# Altium schematic sheet Sheet3.SchDoc
size A; SheetNumber: 3; SheetTotal: 3
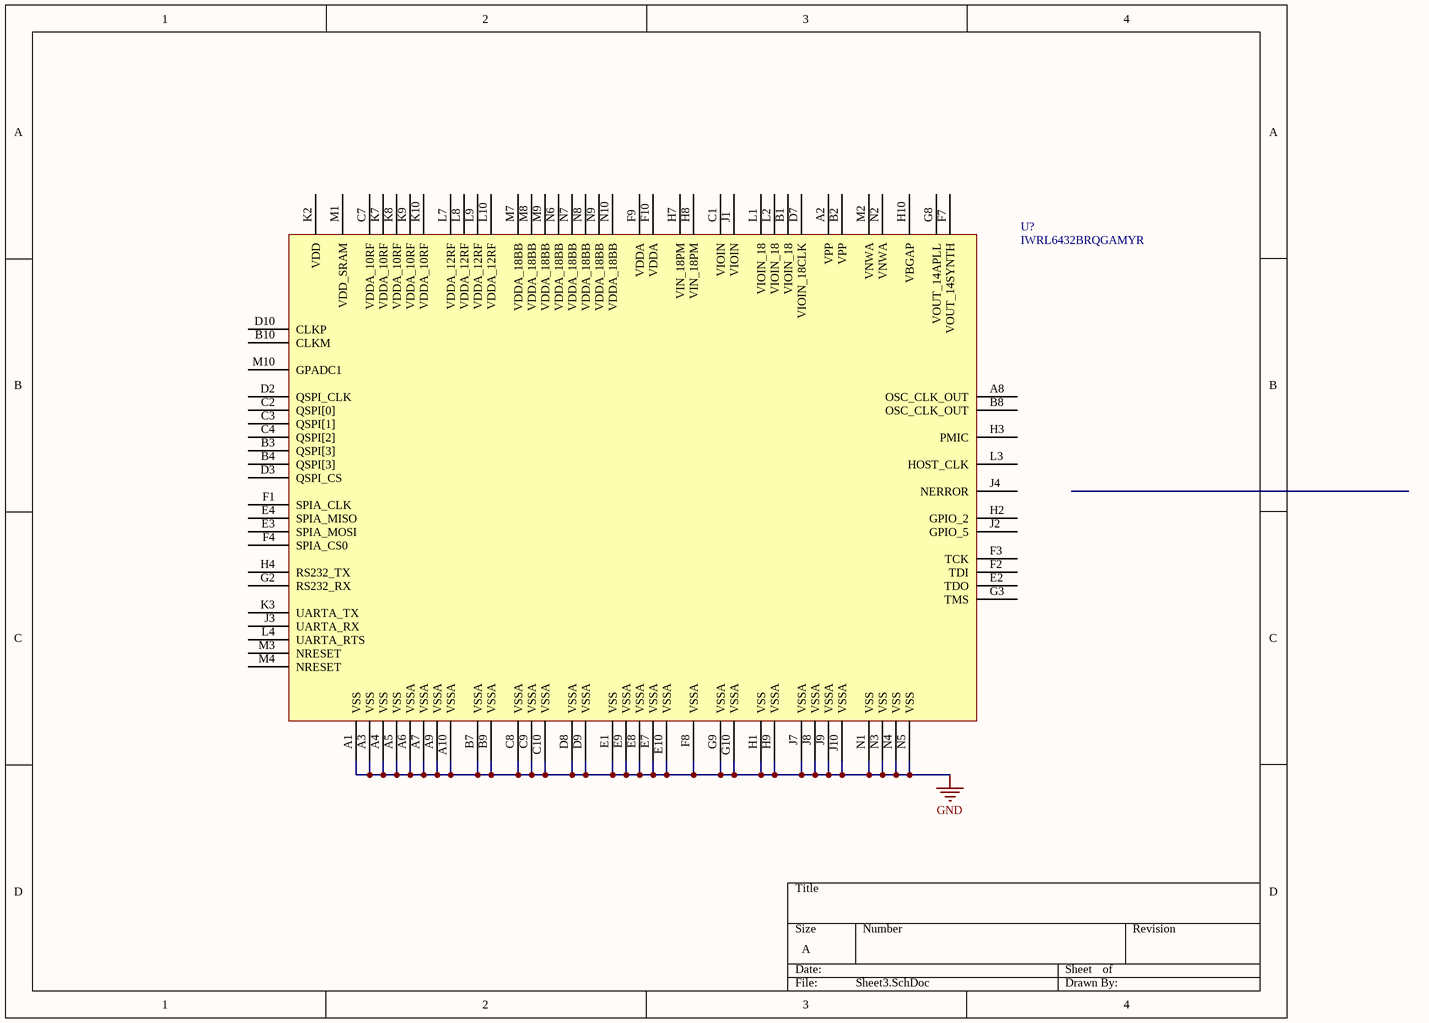
[diagram p0: Sheet3.SchDoc]

## Parts
U?  IWRL6432BRQGAMYR

## Nets
GND: U?.A1(VSS) U?.A3(VSS) U?.A4(VSS) U?.A5(VSS) U?.A6(VSSA) U?.A7(VSSA) U?.A9(VSSA) U?.A10(VSSA) U?.B7(VSSA) U?.B9(VSSA) U?.C8(VSSA) U?.C9(VSSA) U?.C10(VSSA) U?.D8(VSSA) U?.D9(VSSA) U?.E1(VSS) U?.E7(VSSA) U?.E8(VSSA) U?.E9(VSSA) U?.E10(VSSA) U?.F8(VSSA) U?.G9(VSSA) U?.G10(VSSA) U?.H1(VSS) U?.H9(VSSA) U?.J7(VSSA) U?.J8(VSSA) U?.J9(VSSA) U?.J10(VSSA) U?.N1(VSS) U?.N3(VSS) U?.N4(VSS) U?.N5(VSS)

Not connected (* = marked no-connect by the designer): U? A2(VPP) A8(OSC_CLK_OUT) B1(VIOIN_18) B2(VPP) B3(QSPI[3]) B4(QSPI[3]) B8(OSC_CLK_OUT) B10(CLKM) C1(VIOIN) C2(QSPI[0]) C3(QSPI[1]) C4(QSPI[2]) C7(VDDA_10RF) D2(QSPI_CLK) D3(QSPI_CS) D7(VIOIN_18CLK) D10(CLKP) E2(TDO) E3(SPIA_MOSI) E4(SPIA_MISO) F1(SPIA_CLK) F2(TDI) F3(TCK) F4(SPIA_CS0) F7(VOUT_14SYNTH) F9(VDDA) F10(VDDA) G2(RS232_RX) G3(TMS) G8(VOUT_14APLL) H2(GPIO_2) H3(PMIC) H4(RS232_TX) H7(VIN_18PM) H8(VIN_18PM) H10(VBGAP) J1(VIOIN) J2(GPIO_5) J3(UARTA_RX) J4(NERROR) K2(VDD) K3(UARTA_TX) K7(VDDA_10RF) K8(VDDA_10RF) K9(VDDA_10RF) K10(VDDA_10RF) L1(VIOIN_18) L2(VIOIN_18) L3(HOST_CLK) L4(UARTA_RTS) L7(VDDA_12RF) L8(VDDA_12RF) L9(VDDA_12RF) L10(VDDA_12RF) M1(VDD_SRAM) M2(VNWA) M3(NRESET) M4(NRESET) M7(VDDA_18BB) M8(VDDA_18BB) M9(VDDA_18BB) M10(GPADC1) N2(VNWA) N6(VDDA_18BB) N7(VDDA_18BB) N8(VDDA_18BB) N9(VDDA_18BB) N10(VDDA_18BB)

## Library data of the parts
U? = IWRL6432BRQGAMYR: Single-chip low-power 57GHz to 63.5GHz industrial mmWave radar sensor with integrated antenna 101-FCCSP -40 to 105; Manufacturer: Texas Instruments; Manufacturer Lifecycle Status: ACTIVE; Supplier: DigiKey; RoHS: Compliant; Category: Integrated Circuits (ICs); Stock: 660; Pricing: 1=23.37, 10=18.741, 25=17.5856, 100=16.3158, 250=15.71048, 500=15.6646 (USD); Length: 6.7mm; Lifecycle Status: Production; Pins: 101; Thickness: 590µm; Width: 10.9mm; ComponentLink1URL: https://octopart.com:443/opatz8j6/c1?t=Egb_erevs3RStRjh2mlmCnEG9Uh47Pzg3cSpCtnXbFqH-EuG7b0UoPeMwzv6uml3GcXCdAAsWgk-ti-PfCW5k-M0woeo87gnP9JZvt22ZJaH3HWiyj9uubX5N1ltG3cc81QDNrGR6m7xBTt8HxFxUmaG27JTVwD44xpwsGUwPa1RG5SeOAXVQNSJaaLYmU8pO3s9gbtCZkK0ggLPM9_OGtQjvX1SpQi-vOEjoET3vtit91p9E2u7nVmS6IIobeqpa7zFUum8qgXNzRGCQjFKIlVvGfdPqF4FtUiICJ4fmOmq-n0S25o2RTTJy4D3bFrDr4sBQpjhQeg-2d-r6gztwI7SmI0itX5aV5v5A0SyZ9Q0W32DfAc2XU4pqv4lxGxCeXTcFphh-YAX&src-supplier=Texas+Instruments; ComponentLink1Description: https://octopart.com:443/opatz8j6/c1?t=Egb_erevs3RStRjh2mlmCnEG9Uh47Pzg3cSpCtnXbFqH-EuG7b0UoPeMwzv6uml3GcXCdAAsWgk-ti-PfCW5k-M0woeo87gnP9JZvt22ZJaH3HWiyj9uubX5N1ltG3cc81QDNrGR6m7xBTt8HxFxUmaG27JTVwD44xpwsGUwPa1RG5SeOAXVQNSJaaLYmU8pO3s9gbtCZkK0ggLPM9_OGtQjvX1SpQi-vOEjoET3vtit91p9E2u7nVmS6IIobeqpa7zFUum8qgXNzRGCQjFKIlVvGfdPqF4FtUiICJ4fmOmq-n0S25o2RTTJy4D3bFrDr4sBQpjhQeg-2d-r6gztwI7SmI0itX5aV5v5A0SyZ9Q0W32DfAc2XU4pqv4lxGxCeXTcFphh-YAX&src-supplier=Texas+Instruments; ComponentLink2URL: https://datasheet.octopart.com:443/IWRL6432BRQGAMYR-Texas-Instruments-datasheet-191815078.pdf?src-supplier=LCSC; ComponentLink2Description: https://datasheet.octopart.com:443/IWRL6432BRQGAMYR-Texas-Instruments-datasheet-191815078.pdf?src-supplier=LCSC; ComponentLink3URL: http://sigma.octopart.com:80/reach_statement/Texas-Instruments-company-64.pdf?src-supplier=Compliance+Statements; ComponentLink3Description: http://sigma.octopart.com:80/reach_statement/Texas-Instruments-company-64.pdf?src-supplier=Compliance+Statements; ComponentLink4URL: http://sigma.octopart.com:80/conflict_mineral_statement/Texas-Instruments-company-63.pdf?src-supplier=Compliance+Statements; ComponentLink4Description: http://sigma.octopart.com:80/conflict_mineral_statement/Texas-Instruments-company-63.pdf?src-supplier=Compliance+Statements; Supplier Part Number: 296-IWRL6432BRQGAMYRCT-ND; Manufacturer Part Number: IWRL6432BRQGAMYR